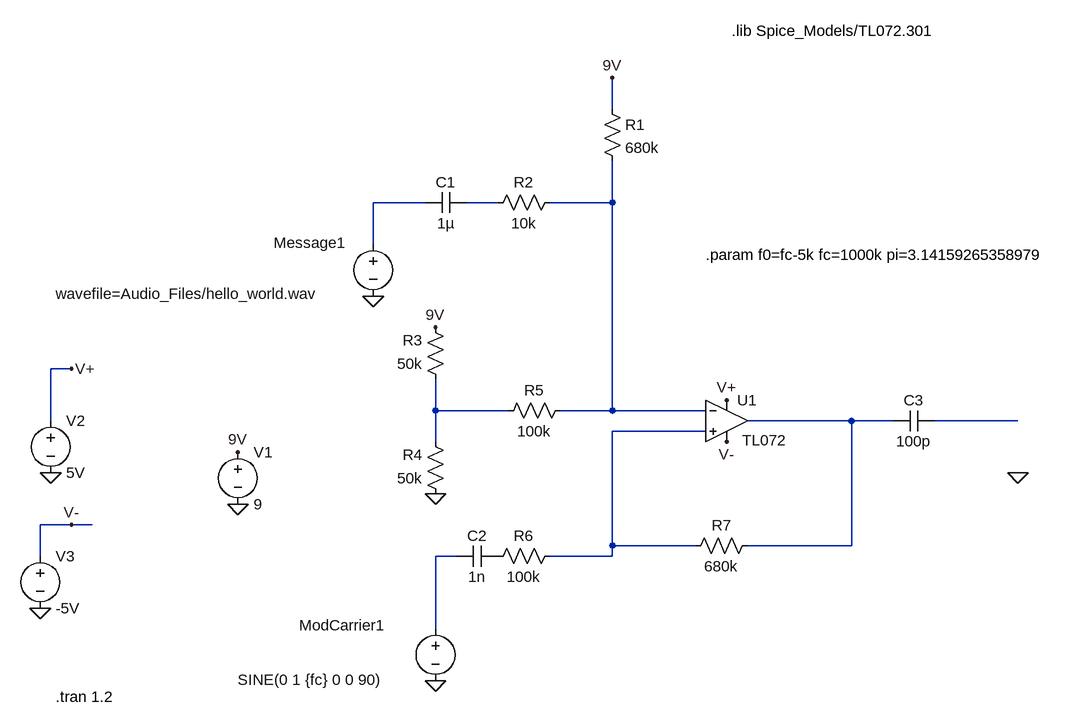
[diagram p0: schematic test_canvas.asc]
test_canvas.asc, the LTspice schematic file:
Version 4
SHEET 1 1292 928
WIRE 384 -112 384 -160
WIRE 96 32 16 32
WIRE 208 32 160 32
WIRE 384 32 384 -32
WIRE 384 32 288 32
WIRE 16 96 16 32
WIRE -448 288 -480 288
WIRE 112 352 112 304
WIRE 224 352 112 352
WIRE 384 352 384 32
WIRE 384 352 304 352
WIRE 528 352 384 352
WIRE -480 368 -480 288
WIRE 752 368 592 368
WIRE 816 368 752 368
WIRE 1008 368 880 368
WIRE 528 384 384 384
WIRE 112 400 112 352
WIRE -448 528 -496 528
WIRE -416 528 -448 528
WIRE 384 560 384 384
WIRE 512 560 384 560
WIRE 752 560 752 368
WIRE 752 560 592 560
WIRE -496 576 -496 528
WIRE 144 576 112 576
WIRE 384 576 384 560
WIRE 384 576 288 576
WIRE 112 688 112 576
FLAG 112 768 0
FLAG 16 176 0
FLAG -192 496 0
FLAG -192 416 9V
FLAG 384 -160 9V
FLAG 112 480 0
FLAG 112 224 9V
FLAG 1008 448 0
FLAG -480 448 0
FLAG -448 288 V+
FLAG -496 656 0
FLAG -448 528 V-
FLAG 560 336 V+
FLAG 560 400 V-
SYMBOL voltage 112 672 R0
WINDOW 123 0 0 Left 0
WINDOW 39 0 0 Left 0
WINDOW 0 -210 10 Left 2
WINDOW 3 -304 94 Left 2
SYMATTR InstName ModCarrier1
SYMATTR Value SINE(0 1 {fc} 0 0 90)
SYMBOL voltage 16 80 R0
WINDOW 0 -153 14 Left 2
WINDOW 3 -488 92 Left 2
SYMATTR InstName Message1
SYMATTR Value wavefile=Audio_Files/hello_world.wav
SYMBOL OpAmps\\UniversalOpAmp 560 368 R0
WINDOW 3 24 30 Left 2
SYMATTR Value TL072
SYMATTR InstName U1
SYMBOL res 368 -128 R0
SYMATTR InstName R1
SYMATTR Value 680k
SYMBOL res 304 16 R90
WINDOW 0 0 56 VBottom 2
WINDOW 3 32 56 VTop 2
SYMATTR InstName R2
SYMATTR Value 10k
SYMBOL res 128 320 R180
WINDOW 0 36 76 Left 2
WINDOW 3 36 40 Left 2
SYMATTR InstName R3
SYMATTR Value 50k
SYMBOL res 128 496 R180
WINDOW 0 36 76 Left 2
WINDOW 3 36 40 Left 2
SYMATTR InstName R4
SYMATTR Value 50k
SYMBOL res 208 368 R270
WINDOW 0 32 56 VTop 2
WINDOW 3 0 56 VBottom 2
SYMATTR InstName R5
SYMATTR Value 100k
SYMBOL res 192 592 R270
WINDOW 0 32 56 VTop 2
WINDOW 3 0 56 VBottom 2
SYMATTR InstName R6
SYMATTR Value 100k
SYMBOL res 608 544 R90
WINDOW 0 0 56 VBottom 2
WINDOW 3 32 56 VTop 2
SYMATTR InstName R7
SYMATTR Value 680k
SYMBOL voltage -192 400 R0
WINDOW 123 0 0 Left 0
WINDOW 39 0 0 Left 0
SYMATTR InstName V1
SYMATTR Value 9
SYMBOL cap 160 16 R90
WINDOW 0 0 32 VBottom 2
WINDOW 3 32 32 VTop 2
SYMATTR InstName C1
SYMATTR Value 1µ
SYMBOL cap 208 560 R90
WINDOW 0 0 32 VBottom 2
WINDOW 3 32 32 VTop 2
SYMATTR InstName C2
SYMATTR Value 1n
SYMBOL cap 880 352 R90
WINDOW 0 0 32 VBottom 2
WINDOW 3 32 32 VTop 2
SYMATTR InstName C3
SYMATTR Value 100p
SYMBOL voltage -480 352 R0
WINDOW 123 0 0 Left 0
WINDOW 39 0 0 Left 0
SYMATTR InstName V2
SYMATTR Value 5V
SYMBOL voltage -496 560 R0
WINDOW 123 0 0 Left 0
WINDOW 39 0 0 Left 0
SYMATTR InstName V3
SYMATTR Value -5V
TEXT 568 -232 Left 2 !.lib Spice_Models/TL072.301
TEXT 528 112 Left 2 !.param f0=fc-5k fc=1000k pi=3.14159265358979
TEXT -472 792 Left 2 !.tran 1.2

The netlist it stands for:
* test_canvas.asc
V§ModCarrier1 N008 0 SINE(0 1 {fc} 0 0 90)
V§Message1 N001 0 wavefile=Audio_Files/hello_world.wav
XU1 N007 N003 V+ V- N005 level1 TL072 Avol=1Meg GBW=10Meg Vos=0 En=0 Enk=0 In=0 Ink=0 Rin=500Meg  ; pins In+ In- V+ V- OUT
R1 9V N003 680k
R2 N003 N002 10k
R3 N004 9V 50k
R4 0 N004 50k
R5 N004 N003 100k
R6 P001 N007 100k
R7 N005 N007 680k
V1 9V 0 9
C1 N002 N001 1µ
C2 P001 N008 1n
C3 N006 N005 100p
V2 V+ 0 5V
V3 V- 0 -5V
.lib Spice_Models/TL072.301
.param f0=fc-5k fc=1000k pi=3.14159265358979
.tran 1.2
.lib UniversalOpAmp1.lib
.backanno
.end